# EAGLE design v1_mainBoard (EAGLE 9.1.0)
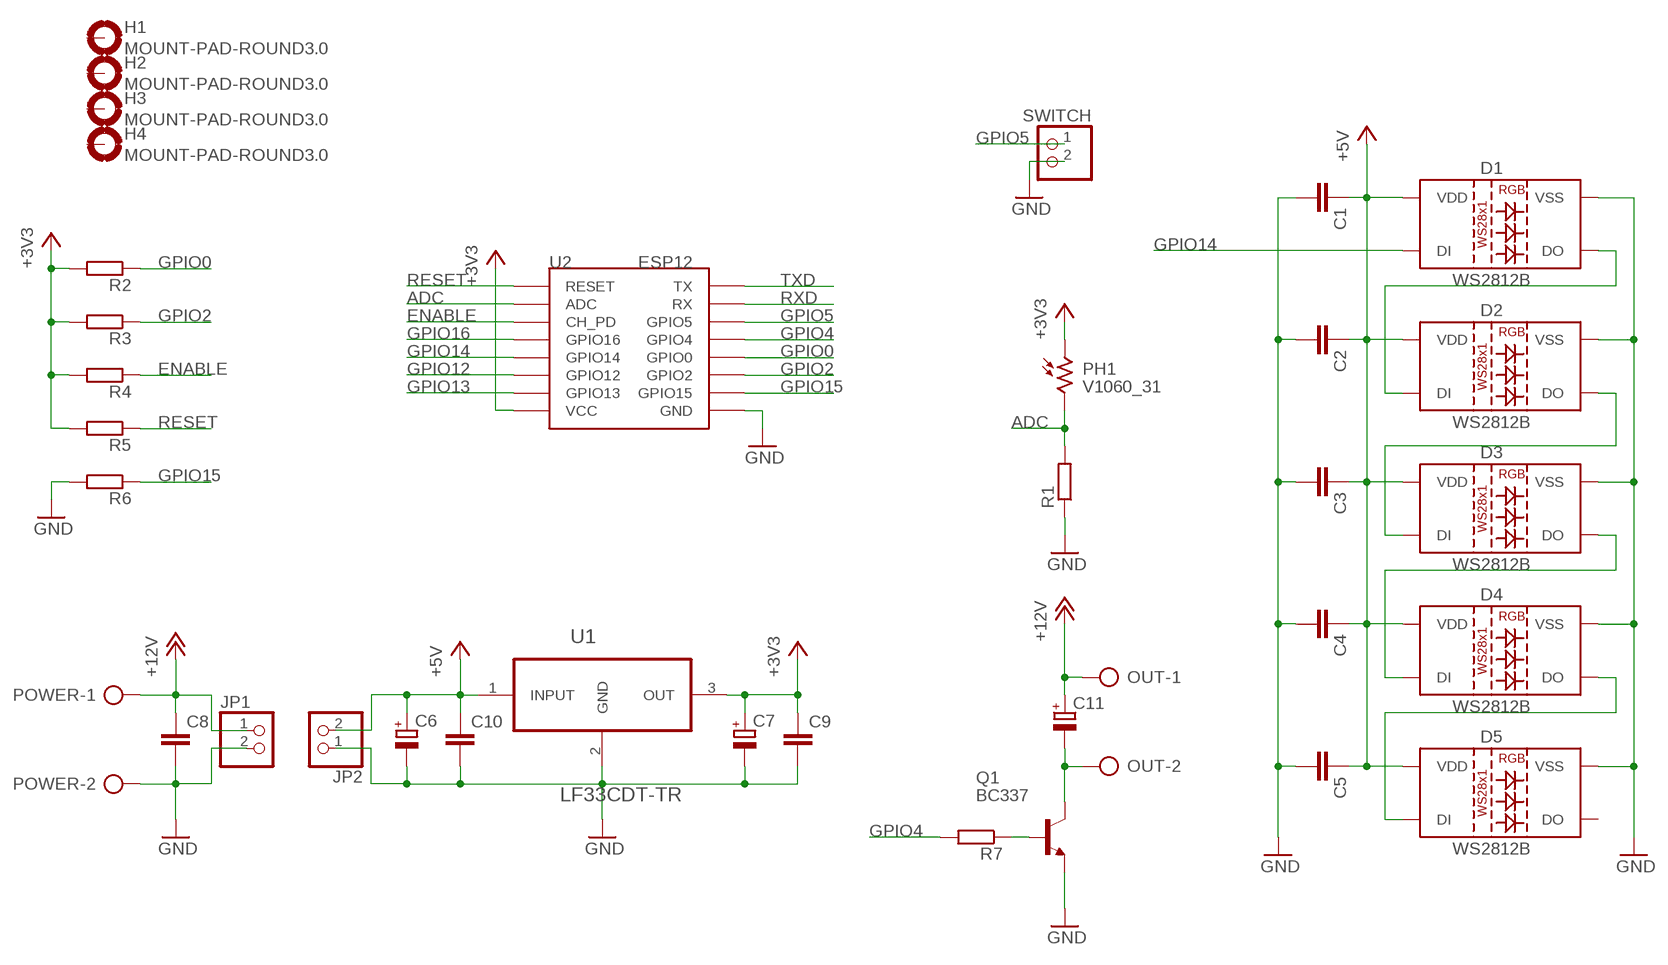
[diagram p0: schematic, sheet 1]

## Parts
C1  C-EUC1206  [C1206]
C2  C-EUC1206  [C1206]
C3  C-EUC1206  [C1206]
C4  C-EUC1206  [C1206]
C5  C-EUC1206  [C1206]
C6  CPOL-EUE2.5-6  [E2,5-6]
C7  CPOL-EUE2.5-6  [E2,5-6]
C8  C-EUC1206  [C1206]
C9  C-EUC1206  [C1206]
C10  C-EUC1206  [C1206]
C11  CPOL-EUE3.5-8  [E3,5-8]
D1  WS2812B  [WS2812B]
D2  WS2812B  [WS2812B]
D3  WS2812B  [WS2812B]
D4  WS2812B  [WS2812B]
D5  WS2812B  [WS2812B]
H1  MOUNT-PAD-ROUND3.0  [3,0-PAD]
H2  MOUNT-PAD-ROUND3.0  [3,0-PAD]
H3  MOUNT-PAD-ROUND3.0  [3,0-PAD]
H4  MOUNT-PAD-ROUND3.0  [3,0-PAD]
JP1  PINHD-1X2  [1X02]
JP2  PINHD-1X2  [1X02]
OUT  AK300/2  [AK300/2]
PH1  V1060_31  [TO-5_V10]
POWER  AK300/2  [AK300/2]
Q1  BC337  [TO92]
R1  R-EU_R1206  [R1206]
R2  R-EU_R1206  [R1206]
R3  R-EU_R1206  [R1206]
R4  R-EU_R1206  [R1206]
R5  R-EU_R1206  [R1206]
R6  R-EU_R1206  [R1206]
R7  R-EU_R1206  [R1206]
SWITCH  PINHD-1X2  [1X02]
U1  LF33CDT-TR  [TO228P972X240-3N]
U2  ESP12  [ESP12]

## Nets
+3V3: C7.+ C9.1 PH1.1 R2.2 R3.2 R4.2 R5.2 U1.3(OUT) U2.VCC
+5V: C1.1 C2.1 C3.1 C4.1 C5.1 C6.+ C10.1 D1.1(VDD) D2.1(VDD) D3.1(VDD) D4.1(VDD) D5.1(VDD) JP2.2 U1.1(INPUT)
+12V: C8.1 C11.+ JP1.1 OUT.1 POWER.1
ADC: PH1.2 R1.2 U2.ADC
ENABLE: R4.1 U2.CH_PD
GND: C1.2 C2.2 C3.2 C4.2 C5.2 C6.- C7.- C8.2 C9.2 C10.2 D1.3(VSS) D2.3(VSS) D3.3(VSS) D4.3(VSS) D5.3(VSS) JP1.2 JP2.1 POWER.2 Q1.1(E) R1.1 R6.2 SWITCH.2 U1.2(GND) U2.GND
GPIO0: R2.1 U2.GPIO0
GPIO2: R3.1 U2.GPIO2
GPIO4: R7.2 U2.GPIO5(GPIO4)
GPIO5: SWITCH.1 U2.GPIO4(GPIO5)
GPIO12: U2.GPIO12
GPIO13: U2.GPIO13
GPIO14: D1.4(DI) U2.GPIO14
GPIO15: R6.1 U2.GPIO15
GPIO16: U2.GPIO16
N$1: C11.- OUT.2 Q1.3(C)
N$3: Q1.2(B) R7.1
N$6: D1.2(DO) D2.4(DI)
N$7: D2.2(DO) D3.4(DI)
N$8: D3.2(DO) D4.4(DI)
N$9: D4.2(DO) D5.4(DI)
RESET: R5.1 U2.RESET
RXD: U2.RX
TXD: U2.TX
Unconnected: D5.2(DO) H1.B3,0(MOUNT) H2.B3,0(MOUNT) H3.B3,0(MOUNT) H4.B3,0(MOUNT)

## Library data of the parts
C1-C5 C8-C10 = rcl:C-EU: CAPACITOR, European symbol; SPICEPREFIX: C
C6 C7 C11 = rcl:CPOL-EU: POLARIZED CAPACITOR, European symbol; SPICEPREFIX: C
D1-D5 = WS2812B:WS2812B: WS2812B SMD addressable RGB LED 5x5mm SMD LED with built-in controller IC. Color: Red/Green/Blue mC Rating: RGB: 390, 660, 180 mcd Forward Voltage: RGB: 2.0, 3.0, 3.0 V Packages:WS2812B SparkFun Products: Blynk Board - ESP8266 <https://www.sparkfun.com/products/13794>; AVAILABILITY: Unavailable; DESCRIPTION: Intelligent Control Led Integrated Light Source Pack Of 10; MF: Worldsemi; MP: WS2812B; PACKAGE: None; PRICE: None
H1-H4 = holes:MOUNT-PAD-ROUND: MOUNTING PAD, round
JP1 JP2 SWITCH = pinhead:PINHD-1X2: PIN HEADER
OUT POWER = con-ptr500:AK300/2: CONNECTOR; OC_FARNELL: unknown; OC_NEWARK: unknown
PH1 = photo-elements:?1060*: Sensor Street Light control Source: http://optoelectronics.perkinelmer.com/content/Datasheets/DTS_PhotocellsB1060.pdf
Q1 = transistor-npn:BC337*: NPN Transistor
R1-R7 = rcl:R-EU_: RESISTOR, European symbol; SPICEPREFIX: R
U1 = LF33CDT-TR:LF33CDT-TR: LDO, 0.45VDO, 1A, 3.3V, 1%, 3TO252; AVAILABILITY: Unavailable; DESCRIPTION: LFXX Series 500 mA 3.3 V Fixed VLDO Voltage Regulator with Inhibit - TO-252; MF: STMicroelectronics; MP: LF33CDT-TR; PACKAGE: TO-252-3 STMicroelectronics; PRICE: None
U2 = esp826612q:ESP12

## Board
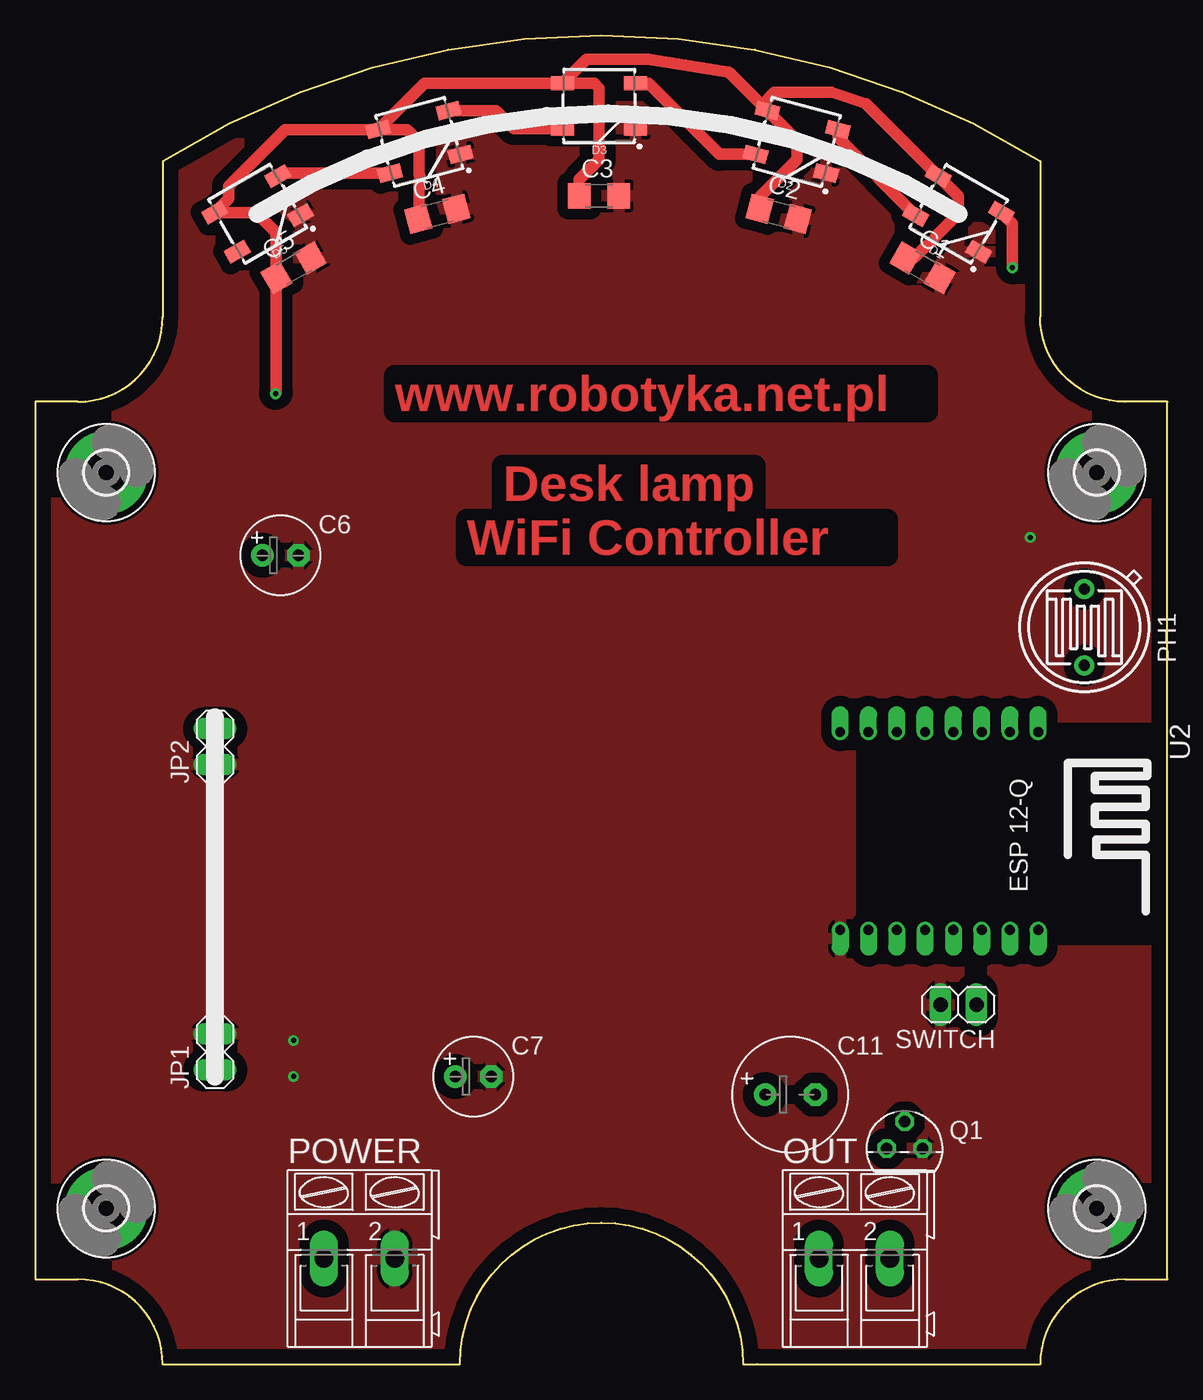
[diagram p1: board, top side]
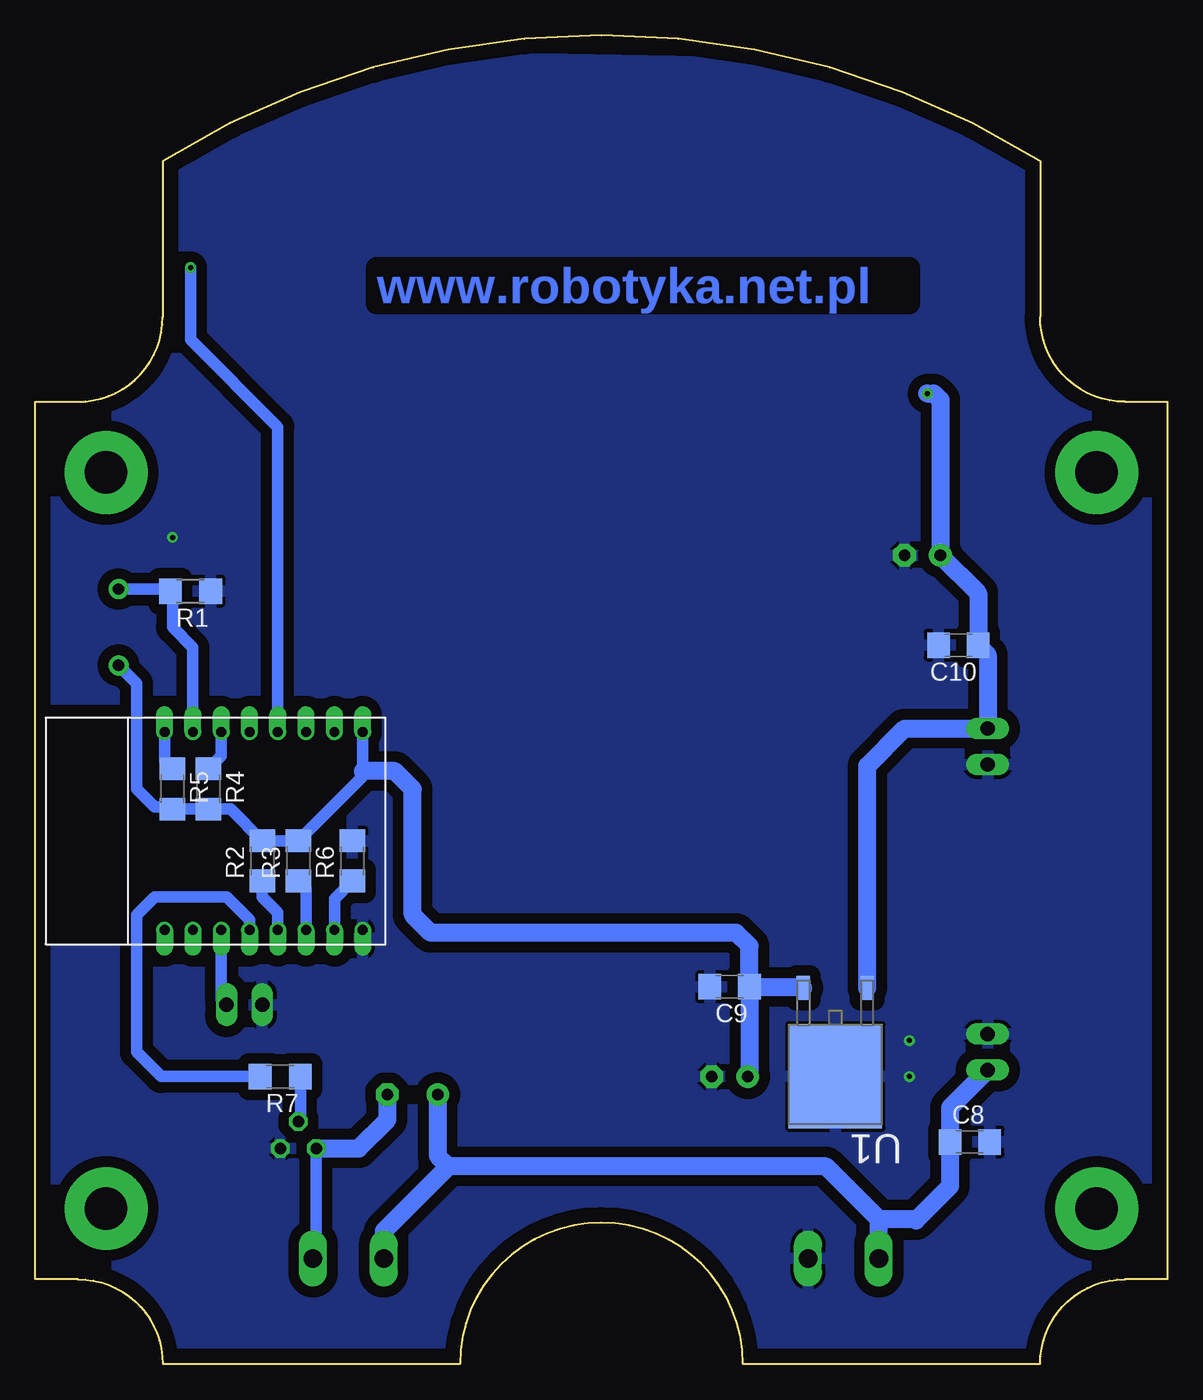
[diagram p2: board, bottom side, seen from below]

Size 80 x 93.89 mm. Coordinates in mm from the lower left corner, seen from the top.
Outline: 9,0 30,0 arc-180 50,0 51,0 71,0 arc-90 77,6 80,6 80,68 77,68 arc-90 71,74 71,85 arc64 9,85 9,74 arc-90 3,68 0,68 0,6 3,6 arc-90 9,0
Copper layers (1*16): Top 0.035mm / dielectric 1.5mm / Bottom 0.035mm
Design rules "default *": minimum track width 6mil, minimum drill 0.35mm, track to track 30mil, track to pad 30mil, pad to pad 6mil, via to via 6mil, smd to smd 6mil, copper to edge 40mil, drill to drill 6mil, minimum pad ring 10mil, minimum via ring 8mil, stop-mask expansion 4mil, vias tented up to drill 0mil, thermal gap 10mil

### Footprints (pad centres in the part's own frame; a part is rotated, then mirrored left to right if it is on the bottom)
C1206 = smd 1.6 x 1.8: 1 -1.4,0; 2 1.4,0
E2,5-6 = drill 0.813 pad 1.6: + -1.27,0 | drill 0.813 pad 1.6 octagon: - 1.27,0
E3,5-8 = drill 0.813 pad 1.6: + -1.778,0 | drill 0.813 pad 1.6 octagon: - 1.778,0
WS2812B = smd 1.651 x 1: 1 2.577,-1.6; 2 2.577,1.6; 3 -2.577,1.6; 4 -2.577,-1.6
3,0-PAD = drill 3 pad 5.842: B3,0 0,0
1X02 = drill 1.016 long: 1 -1.27,0; 2 1.27,0
AK300/2 = drill 1.321 long: 1 -2.515,0; 2 2.489,0
TO-5_V10 = drill 0.8 pad 1.4: 1 -2.7,0; 2 2.7,0
TO92 = drill 0.813 octagon: 1 1.27,0; 2 0,1.905; 3 -1.27,0
R1206 = smd 1.6 x 1.803: 1 -1.422,0; 2 1.422,0
TO228P972X240-3N = smd 0.94 x 1.702: 1 -2.261,-6.096; 3 2.261,-6.096 | smd 6.604 x 7.315: 2 0,0.152
ESP12 = drill 0.7 offset: ADC -7.1,3.8; CH_PD -7.1,1.8; GND 6.9,-8.2; GPIO0 6.9,-2.2; GPIO2 6.9,-4.2; GPIO4 6.9,1.8; GPIO5 6.9,-0.2; GPIO12 -7.1,-4.2; GPIO13 -7.1,-6.2; GPIO14 -7.1,-2.2; GPIO15 6.9,-6.2; GPIO16 -7.1,-0.2; RESET -7.1,5.8; RX 6.9,3.8; TX 6.9,5.8; VCC -7.1,-8.2

### Placement (x,y rotation side)
C1  62.69,77.47 330 top
C2  52.53,81.28 345 top
C3  39.83,82.55 0 top
C4  28.4,81.28 15 top
C5  18.24,77.47 30 top
C6  17.32,57.15 0 top
C7  30.94,20.32 0 top
C8  13.97,15.7 0 bottom
C9  30.94,26.67 180 bottom
C10  14.78,50.8 180 bottom
C11  53.34,19.05 0 top
D1  65.23,81.28 150 top
D2  53.8,86.36 165 top
D3  39.83,88.9 180 top
D4  27.13,86.36 195 top
D5  15.7,81.28 210 top
H1  75,63 0 top
H2  5,63 0 top
H3  75,11 0 top
H4  5,11 0 top
JP1  12.7,22.05 90 top
JP2  12.7,43.64 90 top
OUT  57.9,7.46 0 top
PH1  74.12,52.07 90 top
POWER  22.91,7.46 0 top
Q1  61.42,15.24 0 top
R1  69.04,54.61 180 bottom
R2  63.96,35.56 90 bottom
R3  61.42,35.56 90 bottom
R4  67.77,40.64 270 bottom
R5  70.31,40.64 270 bottom
R6  57.61,35.56 90 bottom
R7  62.69,20.32 180 bottom
SWITCH  65.23,25.4 180 top
U1  23.48,20.48 180 bottom
U2  65.07,37.57 270 top

### Tracks (layer width: path | path; a pad name or v marks a point on that pad's centre or on a via)
+3V3
  Bottom 0.813: U2.VCC 56.87,41.91 56.87,41.53 R3.2 R2.2 66.2,39.22 R4.2 R5.2 70.46,39.37 71.58,39.37 72.85,40.64 72.85,48.1 PH1.1
  Bottom 1.27: 29.45,26.58 C9.1 | C9.1 29.54,20.45 C7.+ | C9.1 29.54,29.54 30.48,30.48 52.07,30.48 53.34,31.75 53.34,40.64 54.61,41.91 56.87,41.91 | C9.1 25.84,26.67 U1.3
+5V  (via drill 0.35)
  Top 0.813: D4.1 26.25,87.24 27.13,86.36 27.13,84.11 27.24,83.71 27.13,83.53 27.13,81 C4.1 | D3.1 39.5,90.5 39.83,90.17 39.83,85.09 38.43,83.69 C3.1 | C2.1 51.18,82.47 53.8,85.09 53.8,86.5 D2.1 51.33,88.97 | C1.1 62.12,78.17 62.87,78.92 62.89,78.95 62.91,78.96 63.23,79.28 63.43,79.33 63.64,79.69 65.23,81.28 65.23,82.52 D1.1 58.7,89.05 56.24,89.86 52.23,89.86 51.33,88.97 | v16.97,68.58 17.03,68.64 C5.1 17.03,79.95 15.6,81.38 D5.1 13.64,82.35 13.64,83.22 17.66,87.24 D4.1 | D4.1 27.49,90.5 29.95,90.5 30.04,90.52 30.08,90.5 D3.1 | D3.1 38.96,92.21 43.27,92.21 49.01,91.29 51.33,88.97
  Bottom 1.27: v16.97,68.58 16.51,68.58 16.05,68.12 C6.+ 13.38,54.48 C10.1 12.7,50.12 JP2.2 18.59,44.91 21.22,42.28 U1.1
+12V
  Bottom 1.27: POWER.1 20.39,10.23 | 20.39,10.23 24.13,13.97 50.8,13.97 | OUT.1 55.38,9.38 50.8,13.97 | JP1.1 15.37,18.11 C8.1 15.37,12.57 17.78,10.16 17.86,10.23 20.39,10.23 | C11.+ 51.56,14.73 50.8,13.97
ADC
  Bottom 0.813: PH1.2 70.62,54.77 R1.2 70.31,54.46 70.31,52.07 68.87,50.63 U2.ADC
ENABLE
  Bottom 0.813: U2.CH_PD 66.87,42.96 R4.1
GND  (via drill 0.35)
  other vias: 18.24,22.86 18.24,20.32 70.31,58.42
  pour Bottom: 0.46,0 80.47,0 80.47,29.21 57.61,29.21 57.61,46.99 80.59,46.99 80.59,92.9 0.46,91.44
  pour Top: 0.46,0 80.47,0 80.47,29.21 57.61,29.21 57.61,36.83 57.61,45.72 80.47,45.72 80.47,91.98 0.46,91.98 0.46,88.25
GPIO0
  Bottom 0.813: U2.GPIO0 62.87,31.93 63.96,33.02 R2.1
GPIO2
  Bottom 0.813: U2.GPIO2 60.87,33.59 R3.1
GPIO4
  Bottom 0.813: U2.GPIO5 64.87,31.39 66.5,33.02 71.58,33.02 72.85,31.75 72.85,22.05 71.12,20.32 R7.2
GPIO5
  Bottom 0.813: U2.GPIO4 66.87,25.77 SWITCH.1
GPIO14  (via drill 0.35)
  Top 0.813: v69.04,77.47 69.04,80.6 D1.4
  Bottom 0.813: U2.GPIO14 62.87,66.22 69.04,72.39 v69.04,77.47
GPIO15
  Bottom 0.813: U2.GPIO15 58.87,32.88 R6.1
N$1
  Bottom 0.813: OUT.2 60.15,7.7 Q1.3
  Bottom 1.27: Q1.3 57.15,15.24 55.12,17.27 C11.-
N$3
  Bottom 0.813: Q1.2 61.27,17.3 R7.1
N$6
  Top 0.813: D1.2 56.7,86.68 D2.4
N$7
  Top 0.813: D3.4 43.34,90.5 48.36,85.48 D2.2
N$8
  Top 0.813: D3.2 33.81,87.3 32.54,88.57 D4.4
N$9
  Top 0.813: D4.2 17.32,84.15 D5.4
RESET
  Bottom 0.813: U2.RESET 70.87,42.62 R5.1

### Text on the board
Top: www.robotyka.net.pl | Desk lamp | WiFi Controller
Bottom: www.robotyka.net.pl